# Altium schematic sheet nRF24L01p.SchDoc
size A4; DocumentNumber: 12; SheetNumber: ALT0056; SheetTotal: 21
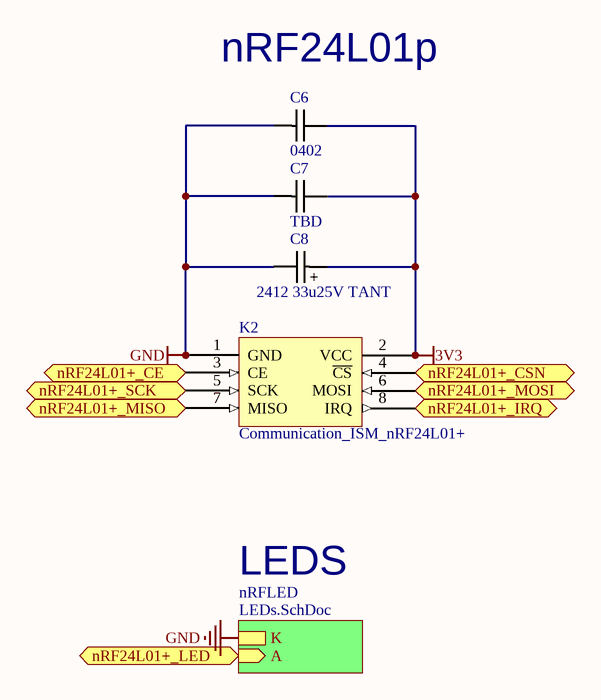
[diagram p0: nRF24L01p.SchDoc]

## Parts
C6  0402  [0402C-TBD]
C7  TBD  [1210C-GENERIC]
C8  2412 33u25V TANT  [2412C+_TANTAL-33u25V]
K2  Communication_ISM_nRF24L01+  [nRF24L01+_SMD]

## Sub-sheets
nRFLED = LEDs.SchDoc: K, A (in)

## Ports
nRF24L01+_CE (in), nRF24L01+_CSN (in), nRF24L01+_IRQ (out), nRF24L01+_LED (in), nRF24L01+_MISO (out), nRF24L01+_MOSI (in), nRF24L01+_SCK (in)

## Nets
3V3: C6.2 C7.2 C8.1 K2.2(VCC)
GND: C6.1 C7.1 C8.2 K2.1(GND) ; sheet nRFLED/K
nRF24L01+_CE: K2.3(CE) ; port nRF24L01+_CE
nRF24L01+_CSN: K2.4(~{CS}) ; port nRF24L01+_CSN
nRF24L01+_IRQ: K2.8(IRQ) ; port nRF24L01+_IRQ
nRF24L01+_LED: port nRF24L01+_LED, sheet nRFLED/A
nRF24L01+_MISO: K2.7(MISO) ; port nRF24L01+_MISO
nRF24L01+_MOSI: K2.6(MOSI) ; port nRF24L01+_MOSI
nRF24L01+_SCK: K2.5(SCK) ; port nRF24L01+_SCK

## Notes on the sheet
- (near C6) nRF24L01p
- LEDS
- Title
- Size:
- Date:
- A4
- Number:
- Time:
- Revision:
- Sheet
- of
- File:
- (in symbol 2412C-TANTAL SIZE C-33u25V) +

## Library data of the parts
C6 = 0402C-TBD: CAPACITOR 0402 CERAMIC
C7 = Passives_Capacitors_1210_1210C-TBD: CAPACITOR 1210 CERAMIC VALUE TO BE DETERMINED
C8 = 2412C-TANTAL SIZE C-33u25V
K2 = Communication_ISM_nRF24L01+: nRF24L01+